# EAGLE design ESP8266Power (EAGLE 7.7.0)
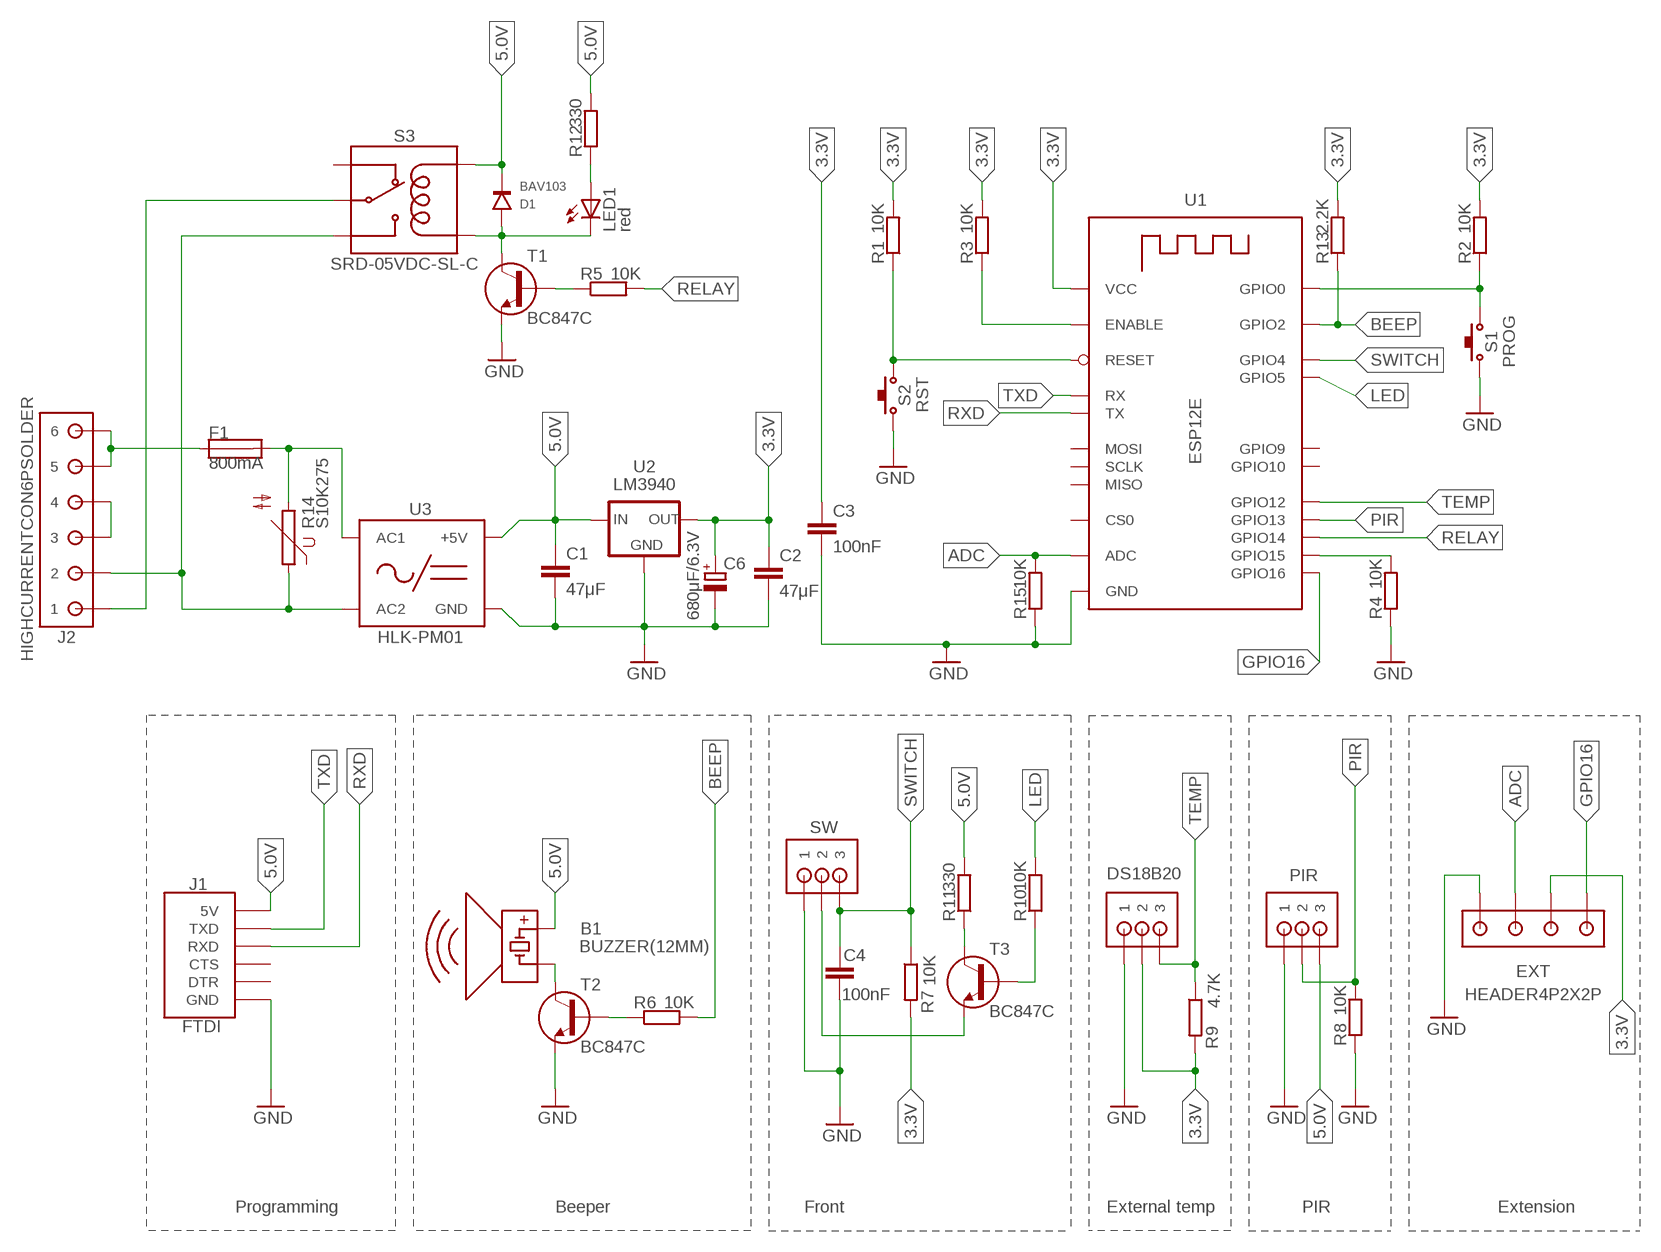
[diagram p0: schematic, sheet 1]

## Parts
B1  BUZZER(12MM)  [BUZZER(12MM)]
C1  47μF  C-EUC1206  [C1206]
C2  47μF  C-EUC1206  [C1206]
C3  100nF  C-EUC1206  [C1206]
C4  100nF  C-EUC1206  [C1206]
C6  680μF/6.3V  CPOL-EUE3.5-8  [E3,5-8]
D1  BAV103  BAV100-101-102-103  [SOD80_DO213AA_MINIMELF]
DS18B20  XH3P  [XH3P]
EXT  HEADER4P2X2P  [HEADER2X2P]
F1  800mA  FUSE  [FUSE_508]
J1  FTDI  [FTDI]
J2  HIGHCURRENTCON6PSOLDER  [HIGHCURRENTCON6P_SOLDER]
LED1  red  LEDCHIPLED_1206  [CHIPLED_1206]
PIR  XH3P  [XH3P]
R1  10K  R-EU_R1206  [R1206]
R2  10K  R-EU_R1206  [R1206]
R3  10K  R-EU_R1206  [R1206]
R4  10K  R-EU_R1206  [R1206]
R5  10K  R-EU_R1206  [R1206]
R6  10K  R-EU_R1206  [R1206]
R7  10K  R-EU_R1206  [R1206]
R8  10K  R-EU_R1206  [R1206]
R9  4.7K  R-EU_R1206  [R1206]
R10  10K  R-EU_R1206  [R1206]
R11  330  R-EU_R1206  [R1206]
R12  330  R-EU_R1206  [R1206]
R13  2.2K  R-EU_R1206  [R1206]
R14  S10K275  [S10K275]
R15  10K  R-EU_R1206  [R1206]
S1  PROG  PUSHBTN  [SMDPUSHBTN_TYPE1]
S2  RST  PUSHBTN  [SMDPUSHBTN_TYPE1]
S3  SRD-05VDC-SL-C  SRD-05VDC-SL-CPTH  [SRD-05VDC-SL-C]
SW  XH3P  [XH3P]
T1  BC847C  BC847  [SOT23]
T2  BC847C  BC847  [SOT23]
T3  BC847C  BC847  [SOT23]
U1  ESP12E  ESP8266(ESP12E)SMD  [ESP8266(ESP12E)]
U2  LM3940  [SOT223]
U3  HLK-PM01  [HLK-PM01]

## Nets
3.3V: C2.1 C3.1 C6.+ DS18B20.2 EXT.2 R1.2 R2.2 R3.2 R7.2 R9.2 R13.2 U1.VCC U2.3(OUT)
5.0V: B1.+ C1.1 D1.C J1.5V PIR.3 R11.2 R12.2 S3.COIL1 U2.1(IN) U3.VO+(+5V)
AC1: F1.2 R14.2 U3.AC1
AC2: J2.2 R14.1 S3.SW-NORMAL_OPEN U3.AC2
ADC: EXT.3 R15.2 U1.ADC
BEEP: R6.2 R13.1 U1.GPIO2
EARTH: J2.3 J2.4
ENABLE: R3.1 U1.CH_PD(ENABLE)
GND: C1.2 C2.2 C3.2 C4.2 C6.- DS18B20.1 EXT.4 J1.GND PIR.1 R4.1 R8.1 R15.1 S1.2 S2.2 SW.1 T1.2(E) T2.2(E) U1.GND U2.2(GND) U2.4(GND) U3.VO-(GND)
GPIO0: R2.1 S1.1 U1.GPIO0
GPIO15: R4.2 U1.GPIO15
GPIO16: EXT.1 U1.GPIO16
LED: R10.2 U1.GPIO5
LOAD: J2.1 S3.SW-COMMON
N$1: R5.1 T1.1(B)
N$2: D1.A LED1.C S3.COIL0 T1.3(C)
N$3: R6.1 T2.1(B)
N$4: B1.- T2.3(C)
N$5: R10.1 T3.1(B)
N$6: R11.1 T3.3(C)
N$7: SW.2 T3.2(E)
N$8: LED1.A R12.1
N$9: F1.1 J2.5 J2.6
PIR: PIR.2 R8.2 U1.GPIO13
RELAY: R5.2 U1.GPIO14
RESET: R1.1 S2.1 U1.RESET
RXD: J1.RXD U1.TXD0(TX)
SWITCH: C4.1 R7.1 SW.3 U1.GPIO4
TEMP: DS18B20.3 R9.1 U1.GPIO12
TXD: J1.TXD U1.RXD0(RX)
Unconnected: J1.CTS J1.DTR S3.SW-NORMAL_CLOSED U1.CS0 U1.GPIO9 U1.GPIO10 U1.MISO U1.MOSI U1.SCLK

## Notes on the sheet
- Programming | Beeper | Front | External temp | PIR | Extension

## Library data of the parts
B1 = 0_HixField:BUZZER(12MM)
C1-C4 = resistor:C-EU: CAPACITOR, European symbol
C6 = resistor:CPOL-EU: POLARIZED CAPACITOR, European symbol
D1 = 0_HixField:BAV100-101-102-103
DS18B20 PIR SW = 0_HixField:XH3P
EXT = 0_HixField:HEADER4P
F1 = 0_HixField:FUSE: FUSE Wickmann; OC_FARNELL: unknown; OC_NEWARK: unknown
J1 = 0_HixField:FTDI
J2 = 0_HixField:HIGHCURRENTCON6P
LED1 = led:LED: LED OSRAM: - CHIPLED LG R971, LG N971, LY N971, LG Q971, LY Q971, LO R971, LY R971 LH N974, LH R974 LS Q976, LO Q976, LY Q976 LO Q996 - Hyper CHIPLED LW Q18S LB Q993, LB Q99A, LB R99A - SideLED LS A670, LO A670, LY A670, LG A670, LP A670 LB A673, LV A673, LT A673, LW A673 LH A674 LY A675 LS A676, LA A676, LO A676, LY A676, LW A676 LS A679, LY A679, LG A679 - Hyper Micro SIDELED® LS Y876, LA Y876, LO Y876, LY Y876 LT Y87S - SmartLED LW L88C, LW L88S LB L89C, LB L89S, LG L890 LS L89K, LO L89K, LY L89K LS L896, LA L896, LO L896, LY L896 - TOPLED LS T670, LO T670, LY T670, LG T670, LP T670 LSG T670, LSP T670, LSY T670, LOP T670, LYG T670 LG T671, LOG T671, LSG T671 LB T673, LV T673, LT T673, LW T673 LH T674 LS T676, LA T676, LO T676, LY T676, LB T676, LH T676, LSB T676, LW T676 LB T67C, LV T67C, LT T67C, LS T67K, LO T67K, LY T67K, LW E67C LS E67B, LA E67B, LO E67B, LY E67B, LB E67C, LV E67C, LT E67C LW T67C LS T679, LY T679, LG T679 LS T770, LO T770, LY T770, LG T770, LP T770 LB T773, LV T773, LT T773, LW T773 LH T774 LS E675, LA E675, LY E675, LS T675 LS T776, LA T776, LO T776, LY T776, LB T776 LHGB T686 LT T68C, LB T68C - Hyper Mini TOPLED® LB M676 - Mini TOPLED Santana® LG M470 LS M47K, LO M47K, LY M47K Source: http://www.osram.convergy.de LUXEON: - LUMILED® LXK2-PW12-R00, LXK2-PW12-S00, LXK2-PW14-U00, LXK2-PW14-V00 LXK2-PM12-R00, LXK2-PM12-S00, LXK2-PM14-U00 LXK2-PE12-Q00, LXK2-PE12-R00, LXK2-PE12-S00, LXK2-PE14-T00, LXK2-PE14-U00 LXK2-PB12-K00, LXK2-PB12-L00, LXK2-PB12-M00, LXK2-PB14-N00, LXK2-PB14-P00, LXK2-PB14-Q00 LXK2-PR12-L00, LXK2-PR12-M00, LXK2-PR14-Q00, LXK2-PR14-R00 LXK2-PD12-Q00, LXK2-PD12-R00, LXK2-PD12-S00 LXK2-PH12-R00, LXK2-PH12-S00 LXK2-PL12-P00, LXK2-PL12-Q00, LXK2-PL12-R00 Source: www.luxeon.com KINGBRIGHT: KA-3528ASYC Source: www.kingbright.com
R1-R6 R8 R10-R13 R15 = rcl:R-EU_: RESISTOR, European symbol
R7 R9 = resistor:R-EU_: RESISTOR, European symbol
R14 = 0_HixField:S10K275: VARISTOR
S1 S2 = 0_HixField:PUSHBTN
S3 = 0_HixField:SRD-05VDC-SL-C: SONGLE RELAY SRD-05VDC-SL-C
T1-T3 = 0_HixField:BC847: 45 V, 100 mA NPN general-purpose transistors NPN general-purpose transistor AAL Eindhoven MK
U1 = 0_HixField:ESP8266(ESP12E): ESP12E Module
U2 = 0_HixField:LM3940
U3 = 0_HixField:HLK-PM01

## Board
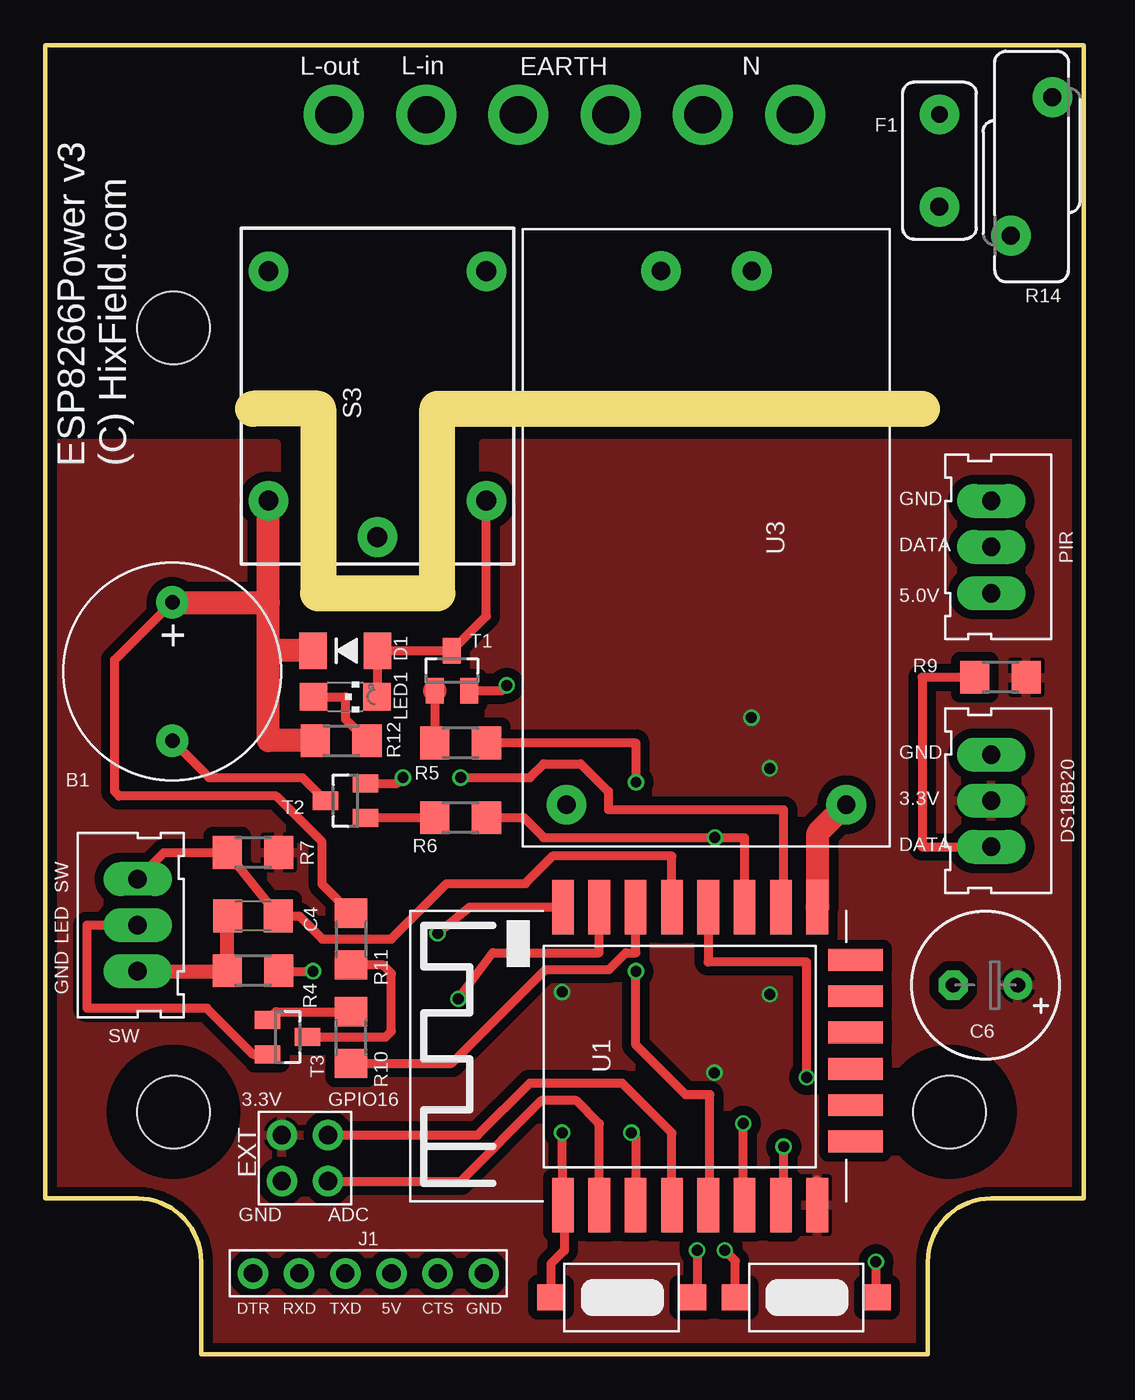
[diagram p1: board, top side]
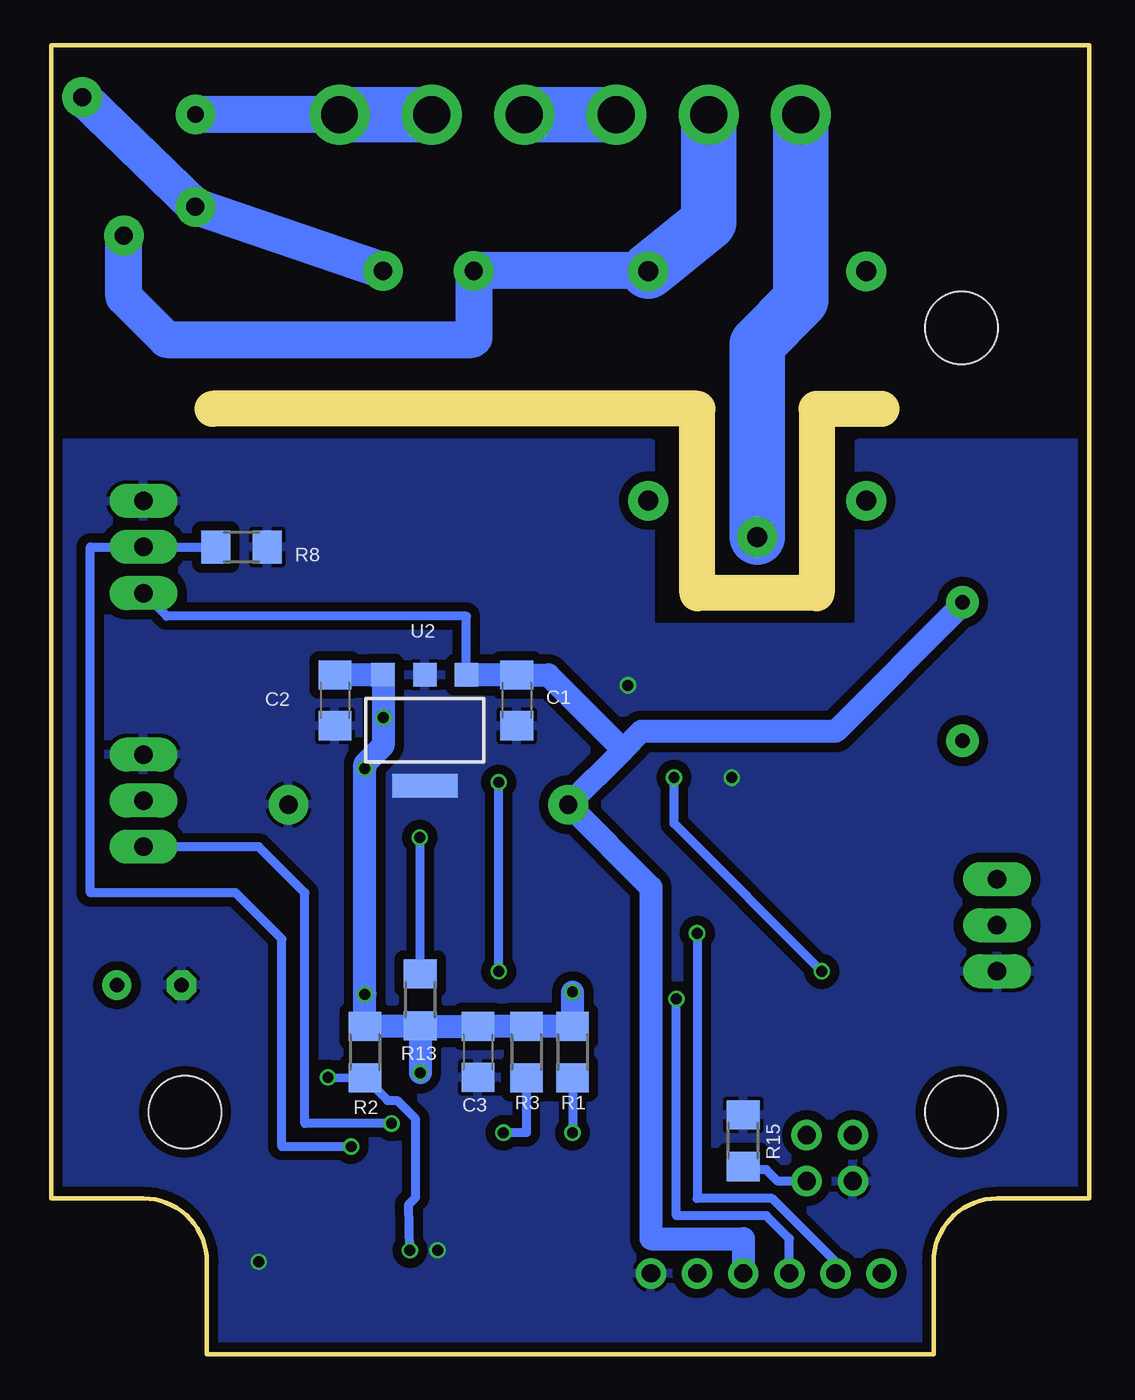
[diagram p2: board, bottom side, seen from below]

Size 57.15 x 72.07 mm. Coordinates in mm from the lower left corner, seen from the top.
Outline: 5.08,8.57 arc-90 8.57,5.08 8.57,0 48.58,0 48.58,5.08 arc-90 52.07,8.57 57.15,8.57 57.15,72.07 0,72.07 0,8.57 5.08,8.57
Copper layers (1*16): Top 0.018mm / dielectric 1.55mm / Bottom 0.018mm
Design rules "eC_2Layer_PClass6_BaseCopperO18_eCDefault *": minimum track width 0.15mm, minimum drill 0.35mm, track to track 0.15mm, track to pad 0.15mm, pad to pad 0.15mm, via to via 0.15mm, smd to smd 0mil, copper to edge 0.25mm, drill to drill 0.35mm, minimum pad ring 0.175mm, minimum via ring 0.125mm, stop-mask expansion 0mil, vias tented up to drill 0.45mm, thermal gap 0.2mm
Holes 4 mm at 7.05,56.52 7.05,13.34 49.78,13.34
tRestrict: area 4,10.3 to 10.1,16.4; area 46.7,10.3 to 52.8,16.4
bRestrict: area 45.8,52.5 to 53.8,60.5
Milling: 5 lines

### Footprints (pad centres in the part's own frame; a part is rotated, then mirrored left to right if it is on the bottom)
BUZZER(12MM) = drill 0.8 pad 1.778: + -3.81,0; - 3.81,0
C1206 = smd 1.6 x 1.8: 1 -1.4,0; 2 1.4,0
E3,5-8 = drill 0.813 pad 1.6: + -1.778,0 | drill 0.813 pad 1.6 octagon: - 1.778,0
SOD80_DO213AA_MINIMELF = smd 1.524 x 2.032: A 1.778,0; C -1.778,0
XH3P = drill 1.016 pad 1.88 long: 1 0,2.54; 2 0,0; 3 0,-2.54
HEADER2X2P = drill 1 pad 1.676: 1 -1.27,1.27; 2 -1.27,-1.27; 3 1.27,1.27; 4 1.27,-1.27
FUSE_508 = drill 0.9 pad 2.184: 1 -2.54,0 | drill 1 pad 2.184: 2 2.54,0
FTDI = drill 1 pad 1.676: 5V 0,5.08; CTS 0,7.62; DTR 0,-2.54; GND 0,10.16; RXD 0,0; TXD 0,2.54
HIGHCURRENTCON6P_SOLDER = drill 2.032 pad 3.302: 1 0,12.7; 2 0,7.62; 3 0,2.54; 4 0,-2.54; 5 0,-7.62; 6 0,-12.7
CHIPLED_1206 = smd 1.5 x 1.5: A 0,-1.75; C 0,1.75
R1206 = smd 1.6 x 1.803: 1 -1.422,0; 2 1.422,0
S10K275 = drill 1 pad 2.184: 1 -1.143,-3.81; 2 1.143,3.81
SMDPUSHBTN_TYPE1 = smd 1.524 x 1.422: 1 -3.924,-0.051; 2 3.873,-0.051
SRD-05VDC-SL-C = drill 1.1 pad 2.184: COIL0 5.39,6.12; COIL1 5.39,-5.88; SW-COMMON 7.39,0.12; SW-NORMAL_CLOSED -7.239,-5.88; SW-NORMAL_OPEN -7.239,6.12
SOT23 = smd 1 x 1.4: 1 -0.95,-1.1; 2 0.95,-1.1; 3 0,1.1
ESP8266(ESP12E) = smd 3 x 1.2: ADC -8.3,3.8; CH_PD -8.3,1.8; GND 8.1,-8.2; GPIO0 8.1,-2.2; GPIO2 8.1,-4.2; GPIO4 8.1,-0.2; GPIO5 8.1,1.8; GPIO12 -8.3,-4.2; GPIO13 -8.3,-6.2; GPIO14 -8.3,-2.2; GPIO15 8.1,-6.2; GPIO16 -8.3,-0.2; RESET -8.3,5.8; RXD0 8.1,3.8; TXD0 8.1,5.8; VCC -8.3,-8.2 | smd 1.2 x 3: CS0 -4.8,-10.3; GPIO9 -0.8,-10.3; GPIO10 1.2,-10.3; MISO -2.8,-10.3; MOSI 3.2,-10.3; SCLK 5.2,-10.3
SOT223 = smd 1.3 x 1.3: 1 -2.3,-3.05; 2 0,-3.05; 3 2.3,-3.05 | smd 3.6 x 1.3: 4 0,3.05
HLK-PM01 = drill 1 pad 2.184: AC1 -14.7,2.5; AC2 -14.7,-2.5; VO+ 14.7,-7.7; VO- 14.7,7.7

### Placement (x,y rotation side)
B1  6.99,37.59 270 top
C1  31.52,36 270 bottom
C2  41.53,36 270 bottom
C3  33.66,16.64 270 bottom
C4  11.43,24.13 180 top
C6  51.75,20.32 180 top
D1  16.51,38.73 0 top
DS18B20  52.07,30.48 0 top
EXT  14.29,10.79 270 top
F1  49.21,65.72 270 top
J1  13.97,4.45 270 top
J2  28.57,68.26 90 top
LED1  16.51,36.2 270 top
PIR  52.07,44.45 0 top
R1  28.45,16.64 90 bottom
R2  39.88,16.64 90 bottom
R3  30.99,16.64 90 bottom
R4  11.43,21.12 0 top
R5  22.86,33.66 0 top
R6  22.86,29.54 0 top
R7  11.43,27.62 0 top
R8  46.67,44.45 180 bottom
R9  52.58,37.27 0 top
R10  16.83,17.44 270 top
R11  16.83,22.86 90 top
R12  16.28,33.78 180 top
R13  36.83,19.51 270 bottom
R14  54.29,65.41 0 top
R15  19.05,11.75 270 bottom
S1  41.91,3.17 0 top
S2  31.75,3.17 0 top
S3  18.16,52.39 270 top
SW  5.08,23.62 180 top
T1  22.38,37.64 0 top
T2  16.51,30.48 90 top
T3  13.34,17.46 270 top
U1  34.29,16.51 90 top
U2  36.58,34.35 180 bottom
U3  36.39,44.96 270 top

### Tracks (layer width: path | path; a pad name or v marks a point on that pad's centre or on a via)
3.3V  (via drill 0.6)
  Top 0.508: U1.VCC 42.49,9.58
  Bottom 1.016: C2.1
  Bottom 1.27: C2.1 U2.3 38.88,33.51 39.88,32.51 v39.88,32.26 v39.88,19.81 R2.2 | 39.88,18.04 R2.2 | C3.1 30.99,18.04 R3.2 R1.2 v28.45,19.94 | C3.1 33.66,18.09 | R13.2 v36.83,15.49 | R13.2 36.83,18.04 C3.1 | R13.2 36.83,18.06 R2.2
  other vias: 38.86,35.05
  pour Top (isolate 0.508): 0,8.89 0,50.16 12.7,50.16 12.7,40.01 24.13,40.01 24.13,50.16 57.15,50.16 57.15,8.89 52.07,8.89 arc90 48.26,5.08 48.26,0 8.89,0 8.89,5.08 arc90 5.08,8.89
5.0V
  Top 0.508: R11.2 15.24,25.87 15.24,28.19 12.7,30.73 4.06,30.73 3.81,30.99 3.81,38.23 B1.+
  Top 1.27: 12.28,38.73 12.28,41.4 | 12.28,41.4 S3.COIL1 | D1.C 12.28,38.73 | R12.2 12.28,33.78 12.28,38.73 | B1.+ 12.28,41.4
  Bottom 0.508: U2.1 34.29,37.42 34.29,40.64 50.8,40.64 PIR.3
  Bottom 1.016: U2.1
  Bottom 1.27: U2.1 C1.1 29.79,37.4 25.66,33.28 | B1.+ 6.99,41.27 13.97,34.29 24.65,34.29 25.66,33.28 | 25.66,33.28 U3.VO+ 24.13,25.7 24.13,6.35 19.05,6.35 J1.5V
AC1
  Bottom 2.032: R14.2 F1.2 U3.AC1
AC2
  Bottom 1.524: S3.SW-NORMAL_OPEN 24.28,59.66 | 33.89,55.97 33.97,55.88
  Bottom 2.032: 24.28,59.66 U3.AC2 33.89,55.97 | 33.97,55.88 50.8,55.88 53.15,58.23 R14.1
  Bottom 3.048: J2.2 20.95,62.32 S3.SW-NORMAL_OPEN
ADC
  Top 0.508: U1.ADC 30.49,12.69 29.21,13.97 27.3,13.97 22.86,9.53 EXT.3
  Bottom 0.508: EXT.3 17.14,9.53 17.78,10.16 18.88,10.16 R15.2
BEEP  (via drill 0.6)
  Top 0.508: R6.2 26.34,29.54 27.43,28.45 v36.85,28.45 38.49,28.45 U1.GPIO2
  Bottom 0.508: R13.1 36.83,28.45 v36.85,28.45
EARTH
  Bottom 3.048: J2.3 J2.4
ENABLE  (via drill 0.6)
  Top 0.508: v32.26,12.19 32.49,11.96 U1.CH_PD
  Bottom 0.508: R3.1 30.99,12.19 v32.26,12.19
GND  (via drill 0.6)
  Top 0.508: T2.2 19.36,31.43 v19.68,31.75 | T1.2 25.11,36.54 v25.4,36.83 | v45.72,5.08 45.72,3.19 S1.2 | 35.56,3.19 S2.2 35.88,3.38 v35.88,5.71
  Top 0.762: SW.1 9.97,21.08 R4.1 10.01,24.11 C4.2
  Top 1.27: U1.GND 42.52,24.64 42.52,28.69 U3.VO-
  pour Bottom (isolate 0.508): 0,8.89 0,50.16 12.7,50.16 12.7,40.01 24.13,40.01 24.13,50.16 57.15,50.16 57.15,8.89 52.07,8.89 arc90 48.26,5.08 48.26,0 8.89,0 8.89,5.08 arc90 5.08,8.89
GPIO0  (via drill 0.6)
  Top 0.508: v41.91,15.24 41.91,21.59 36.49,21.59 U1.GPIO0 | S1.1 37.99,5.13 v37.4,5.71
  Bottom 0.508: v41.91,15.24 R2.1 38.63,13.97 38.1,13.97 37.08,12.95 37.08,8.64 37.47,8.26 v37.4,5.71
GPIO15  (via drill 0.6)
  Top 0.508: v22.86,31.75 26.67,31.75 27.43,32.51 29.46,32.51 30.99,30.99 30.99,29.97 40.64,29.97 40.64,24.61 U1.GPIO15 | R4.2 12.85,21.08 v14.73,21.08
  Bottom 0.508: v14.73,21.08 22.86,29.21 v22.86,31.75
GPIO16
  Top 0.508: U1.GPIO16 34.49,12.18 31.75,14.92 26.67,14.92 23.81,12.06 EXT.1
LED
  Top 0.508: R10.2 22.36,16.02 27.53,21.18 31.04,21.18 31.95,22.1 32.51,22.1 32.51,24.59 U1.GPIO5
LOAD
  Bottom 3.048: S3.SW-COMMON 18.29,55.63 15.88,58.04 J2.1
N$1
  Top 0.508: T1.1 R5.1
  Top 1.27: T1.1
N$2
  Top 0.508: 18.29,36.22 D1.A | 18.3,38.74 T1.3 24.28,40.65 S3.COIL0
  Top 1.27: LED1.C 18.29,36.22 | D1.A 18.3,38.74
N$3
  Top 0.508: T2.1 R6.1
N$4
  Top 0.508: B1.- 9.02,31.75 14.14,31.75 T2.3
N$5
  Top 0.508: T3.1 12.68,18.86 R10.1
N$6
  Top 0.508: T3.3 18.73,17.46 19.05,17.78 19.05,20.95 18.57,21.44 R11.1
N$7
  Top 0.508: T3.2 11.43,16.51 8.89,19.05 2.29,19.05 2.29,23.62 SW.2
N$8
  Top 0.508: LED1.A 16.51,36.2 16.51,34.98 R12.1
  Top 1.27: LED1.A
N$9
  Bottom 2.032: J2.6 F1.1
  Bottom 3.048: J2.5 J2.6
PIR  (via drill 0.6)
  Top 0.508: U1.GPIO13 40.64,8.06 v40.64,11.43
  Bottom 0.508: v40.64,11.43 44.45,11.43 44.45,22.86 46.99,25.4 54.99,25.4 54.99,44.45 PIR.2 R8.2
RELAY  (via drill 0.6)
  Top 0.508: U1.GPIO14 36.58,8.3 36.58,14.29 35.24,14.29 32.51,17.02 v32.51,21.08 | R5.2 32.51,33.66 v32.51,31.5
  Bottom 0.508: v32.51,21.08 v32.51,31.5
RESET  (via drill 0.6)
  Top 0.508: U1.RESET v28.45,12.19 | 28.54,8.16 U1.RESET | U1.RESET 28.57,8.12 28.57,5.71 27.83,4.97 S2.1
  Bottom 0.508: R1.1 v28.45,12.19
RXD  (via drill 0.6)
  Top 0.508: U1.TXD0 23.34,24.61 v21.59,23.18
  Bottom 0.508: v21.59,23.18 21.59,8.57 17.46,8.57 13.97,5.08 J1.RXD
SWITCH
  Top 0.508: SW.3 6.54,27.62 R7.1 C4.1 13.97,24.13 15.24,22.86 19.05,22.86 22.1,25.91 26.42,25.91 27.94,27.43 34.49,27.43 U1.GPIO4
TEMP  (via drill 0.6)
  Top 0.406: U1.GPIO12 38.42,8.21
  Top 0.508: 38.42,8.21 v38.42,12.7 | R9.1 48.26,37.27 48.26,27.94 DS18B20.3
  Bottom 0.508: v38.42,12.7 43.18,12.7 43.18,25.4 45.72,27.94 DS18B20.3
TXD  (via drill 0.6)
  Top 0.508: v22.73,19.56 24.64,22.1 30.48,22.1 U1.RXD0
  Bottom 0.508: v22.73,19.56 22.73,7.62 17.78,7.62 16.51,6.35 J1.TXD

### Text on the board
tNames: L-out | L-in | EARTH | N | ESP8266Power v3 | (C) HixField.com | GND | DATA | 5.0V | GND | 3.3V | DATA | SW | LED | GND | 3.3V | GPIO16 | GND | ADC